# EAGLE design srf_filter (EAGLE 7.5.0)
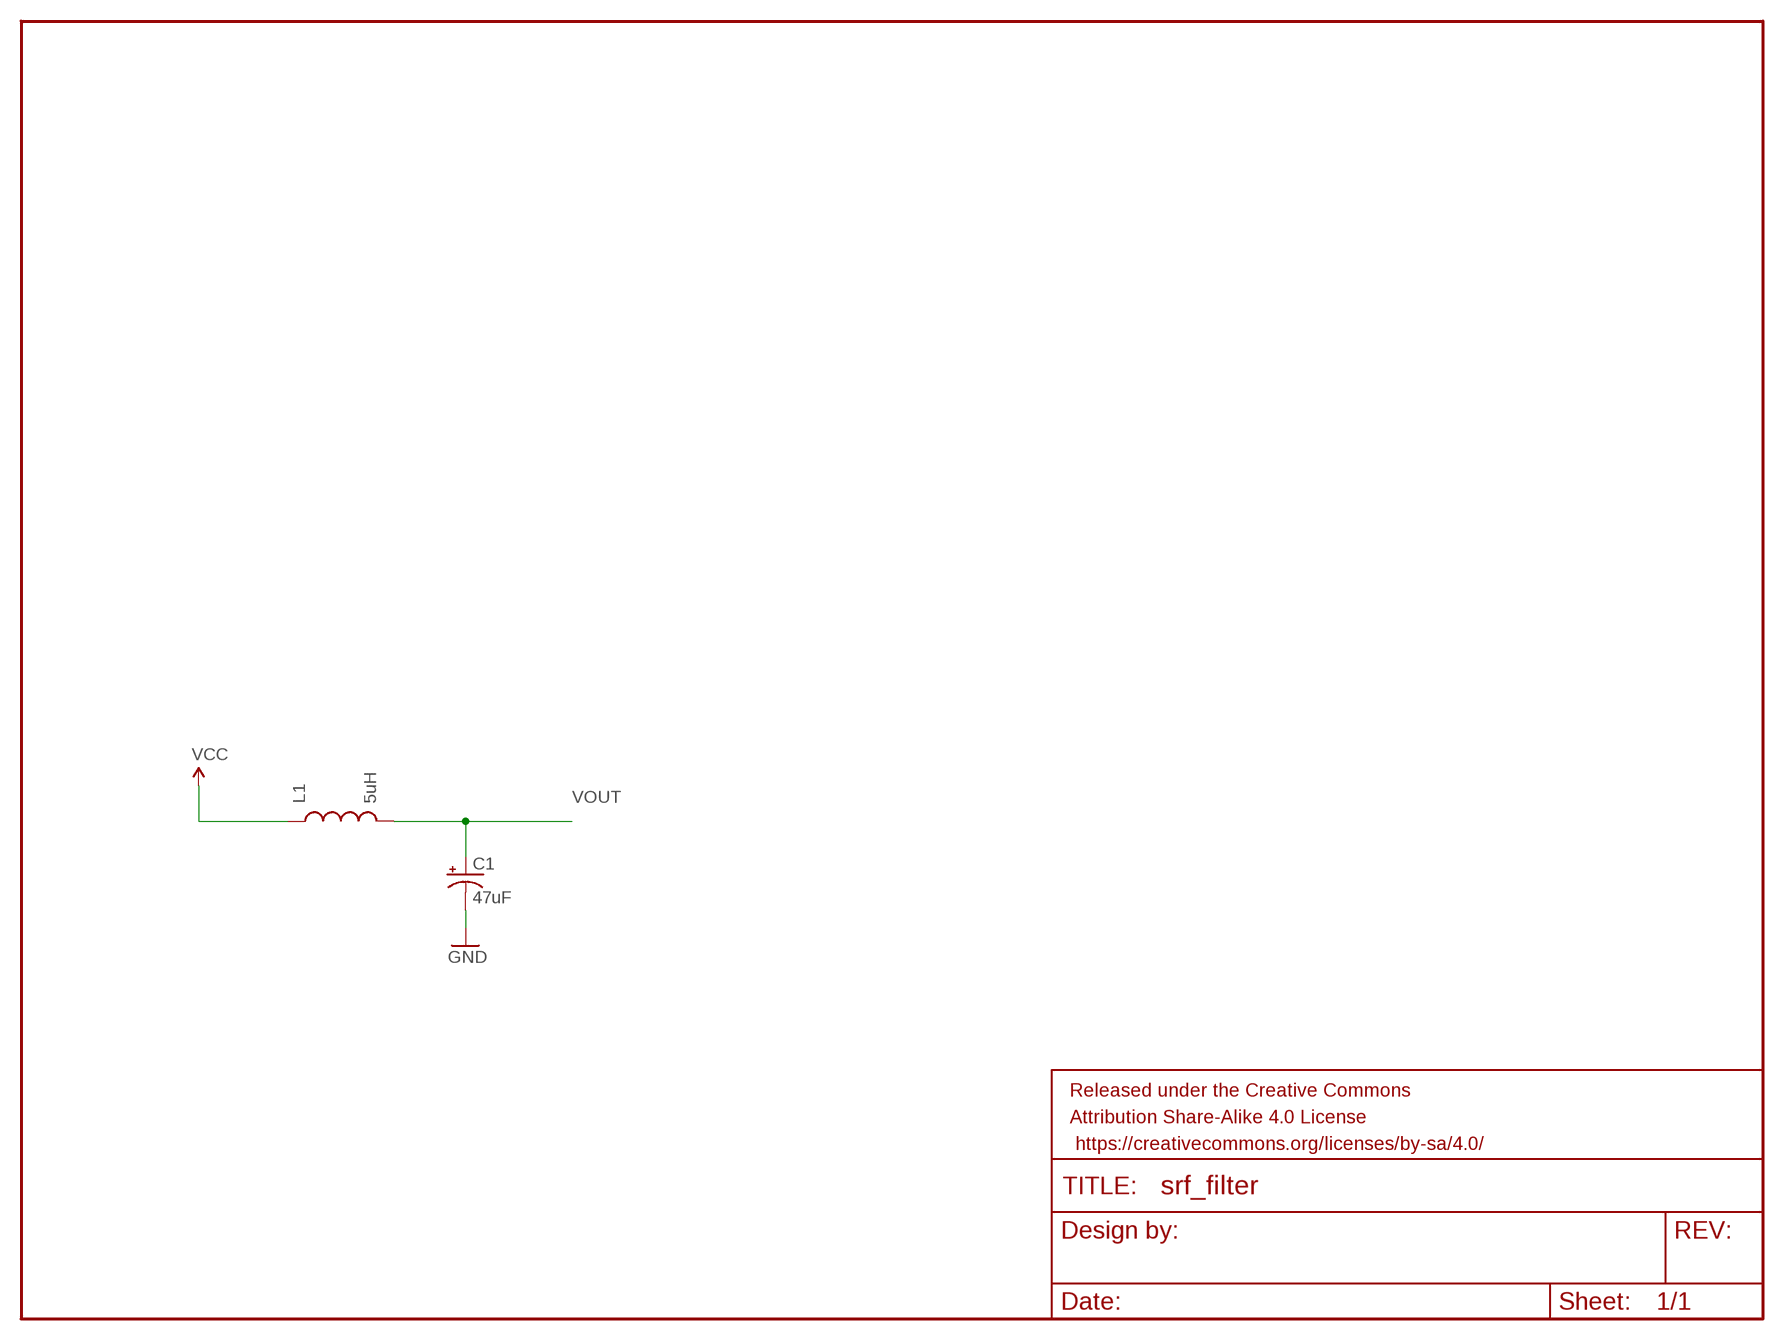
[diagram p0: schematic, sheet 1]

## Parts
C1  47uF  CAP_POLD  [PANASONIC_D]
FRAME1  FRAME-LETTER  [CREATIVE_COMMONS]
L1  5uH  INDUCTORBOURNS_SRN6045  [SRN6045]

## Nets
GND: C1.-
VCC: L1.1
VOUT: C1.+ L1.2

## Library data of the parts
C1 = SparkFun-Passives:CAP_POL: Capacitor Polarized These are standard SMD and PTH capacitors. Normally 10uF, 47uF, and 100uF in electrolytic and tantalum varieties. Always verify the external diameter of the through hole cap, it varies with capacity, voltage, and manufacturer. The EIA devices should be standard.
FRAME1 = SparkFun-Aesthetics:FRAME-LETTER: Schematic Frame Standard 8.5x11 US Letter frame; DESIGNER: NAME; VERSION: v01
L1 = SparkFun-Passives:INDUCTOR: Inductors Basic Inductor/Choke - 0603 and 1206. Footprints are not proven and vary greatly between part numbers. SRN6045- 33uH, 20% 1.4A SDR0403-560KL - 56uH, 10%, 500mA RMS/740mA peak; PROD_ID: NDUC-11627; VALUE: 33uH

## Board
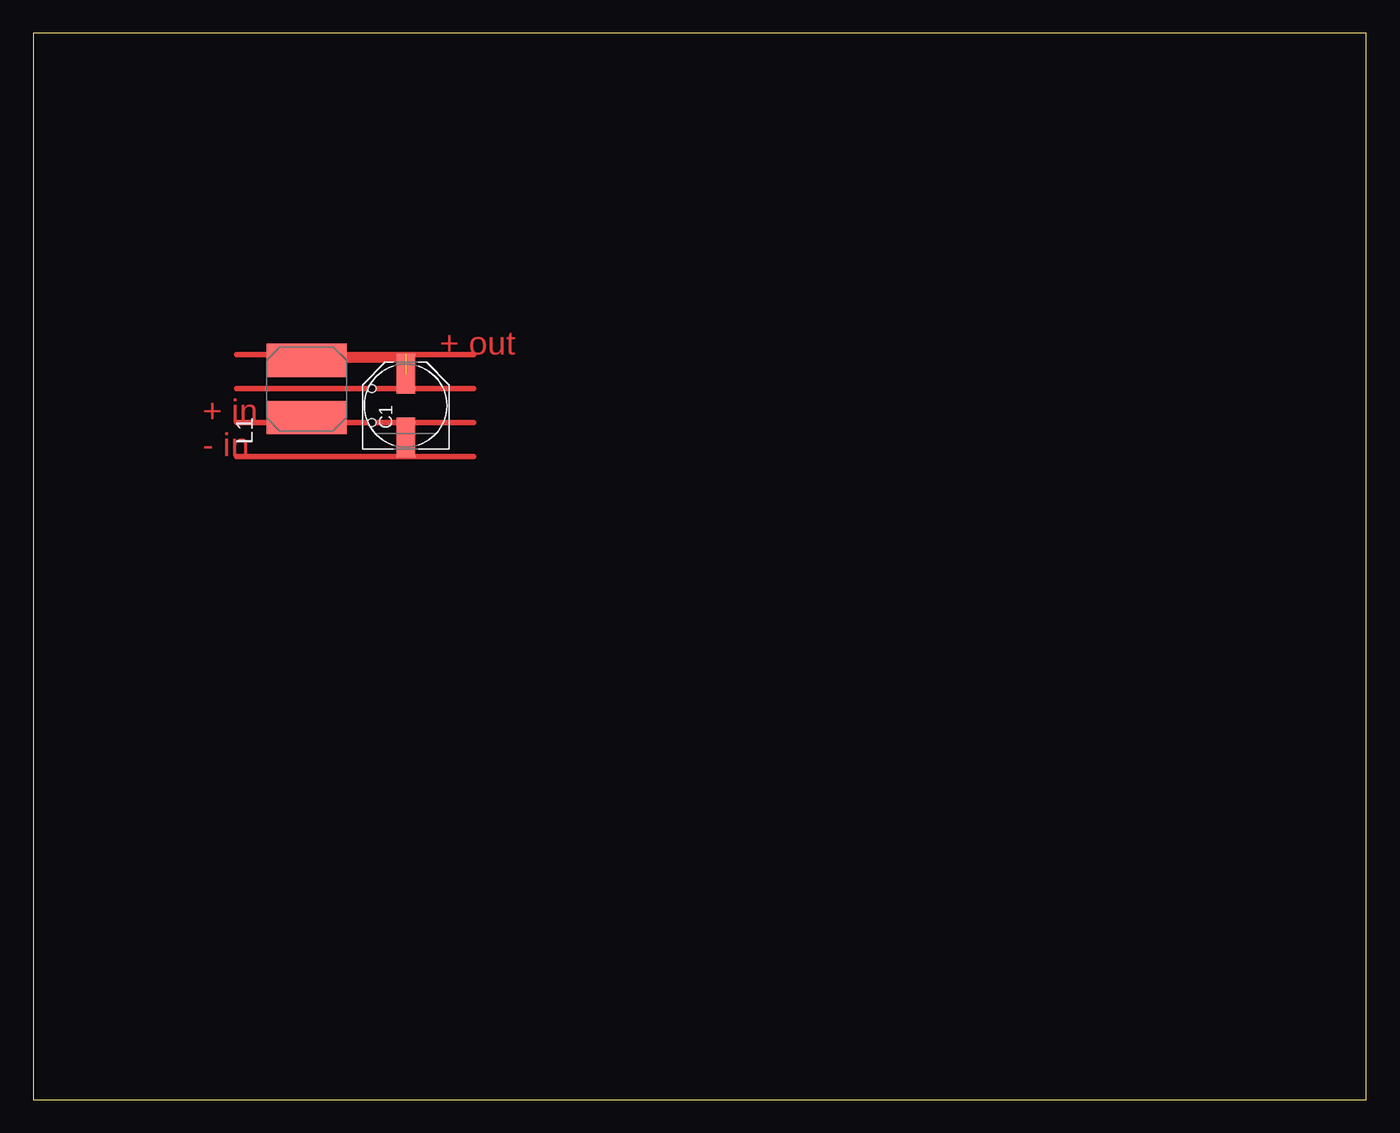
[diagram p1: board, top side]

Size 100 x 80 mm. Coordinates in mm from the lower left corner, seen from the top.
Outline: 0,0 100,0 100,80 0,80 0,0
Copper layers (1*16): Top 0.035mm / dielectric 1.5mm / Bottom 0.035mm
Design rules "default": minimum track width 10mil, minimum drill 24mil, track to track 8mil, track to pad 8mil, pad to pad 8mil, via to via 8mil, smd to smd 8mil, copper to edge 40mil, drill to drill 8mil, minimum pad ring 10mil, minimum via ring 8mil, stop-mask expansion 4mil, vias tented up to drill 0mil, thermal gap 10mil
Holes 0.6 mm at 25.4,53.34 25.4,50.8

### Footprints (pad centres in the part's own frame; a part is rotated, then mirrored left to right if it is on the bottom)
PANASONIC_D = smd 3 x 1.4: + 2.4,0; - -2.4,0
SRN6045 = smd 2.5 x 6: 1 -2.175,-0.175; 2 2.125,-0.175

### Placement (x,y rotation side)
C1  27.94,52.07 90 top
FRAME1  -101.6,13.97 0 top  (outside the outline)
L1  20.32,53.34 90 top

### Tracks (layer width: path | path; a pad name or v marks a point on that pad's centre or on a via)
N$1
  Top 0.406: 33.02,55.88 15.24,55.88
N$2
  Top 0.406: 33.02,50.8 15.24,50.8
N$3
  Top 0.406: 33.02,48.26 15.24,48.26
N$4
  Top 0.406: 15.24,53.34 33.02,53.34
VOUT  (1 unrouted)
  Top 0.406: L1.2 27.94,55.47 27.94,55.88

### Text on the board
Top: + out | + in | - in